# Altium schematic sheet FPGA_MGT.SchDoc: =ProjectTitle
size A3; Author: Jaime I. Chait; Organization: NWES LLC; Address1: 111 SW 5th Ave, STE 3150; Address2: Portland, OR 97204; SheetNumber: 16; SheetTotal: 19
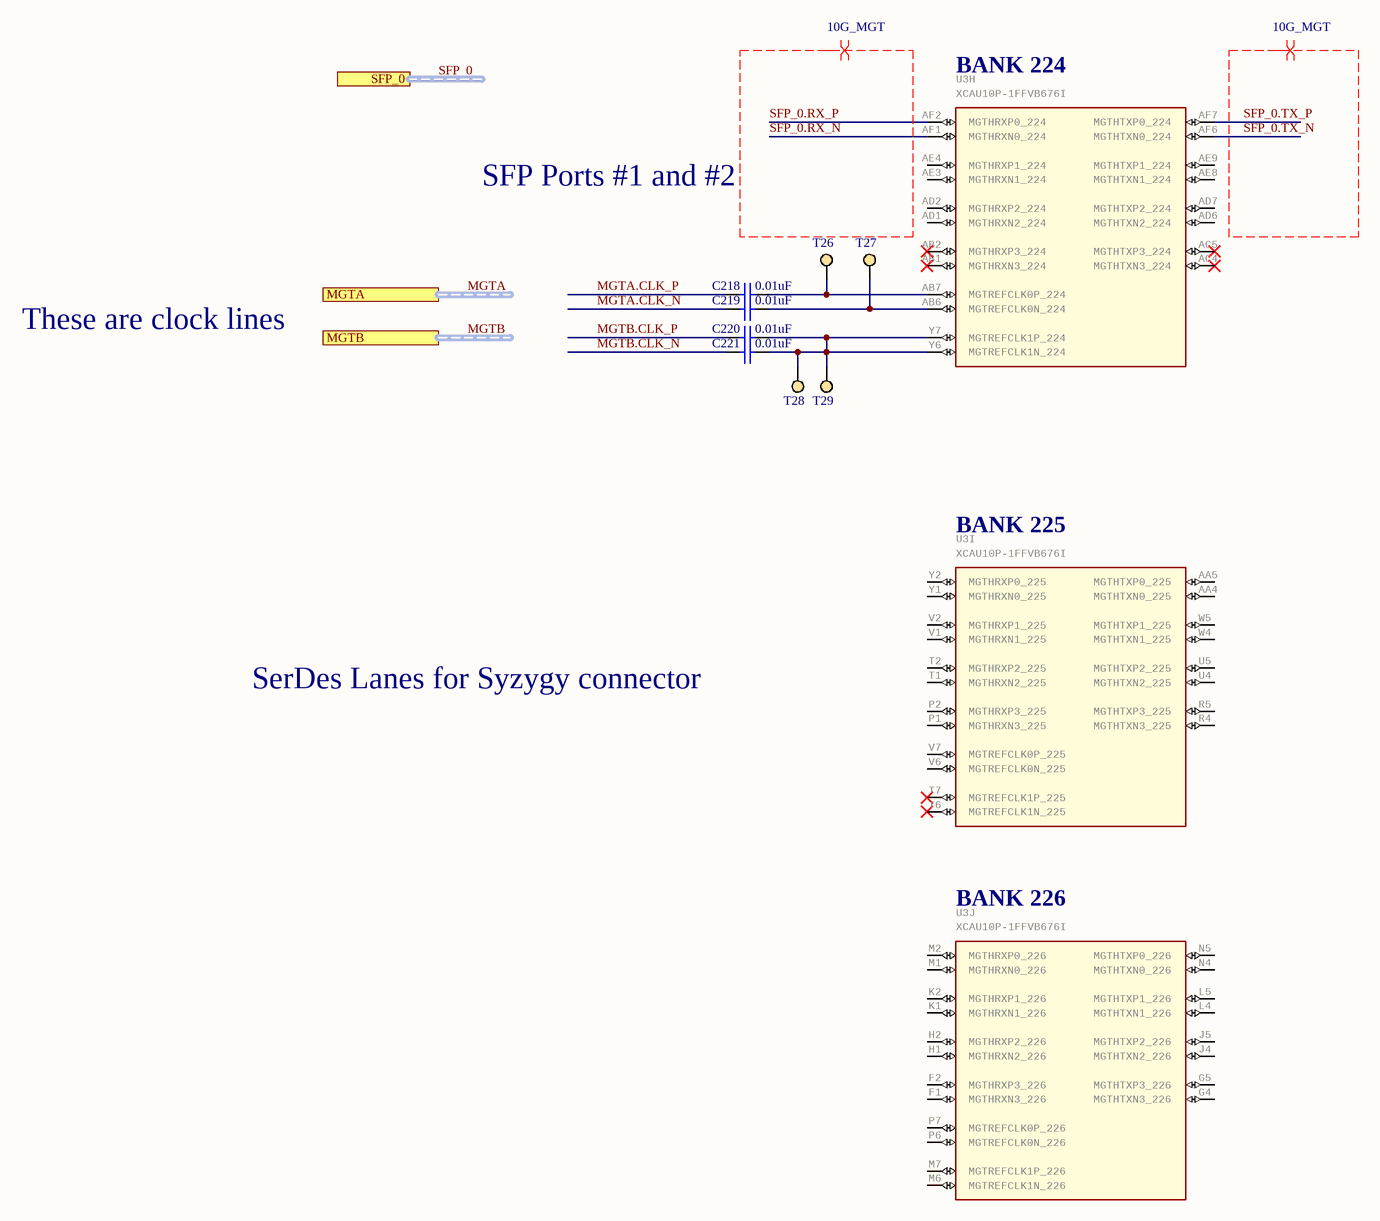
[diagram p0: FPGA_MGT.SchDoc]

## Parts
C218  0.01uF  [CAPC1005X55USR]
C219  0.01uF  [CAPC1005X55USR]
C220  0.01uF  [CAPC1005X55USR]
C221  0.01uF  [CAPC1005X55USR]
T26  TP_S  [TP_SM_1MM]  (value not drawn)  (no BOM)
T27  TP_S  [TP_SM_1MM]  (value not drawn)  (no BOM)
T28  TP_S  [TP_SM_1MM]  (value not drawn)  (no BOM)
T29  TP_S  [TP_SM_1MM]  (value not drawn)  (no BOM)
U3  XCAU10P-1FFVB676I  [676-FCBGA (27x27)]  (parts H,I,J of 16)

## Ports
MGTA (harness DIFF_CLK), MGTB (harness DIFF_CLK), SFP_0 (harness SFT_MGT)

## Nets
MGTA.CLK_N: C219.1
MGTA.CLK_P: C218.1
MGTB.CLK_N: C221.1
MGTB.CLK_P: C220.1
SFP_0.RX_N: U3.AF1(MGTHRXN0_224)
SFP_0.RX_P: U3.AF2(MGTHRXP0_224)
SFP_0.TX_N: U3.AF6(MGTHTXN0_224)
SFP_0.TX_P: U3.AF7(MGTHTXP0_224)
NetC218_2: C218.2 T26.1 U3.AB7(MGTREFCLK0P_224)
NetC219_2: C219.2 T27.1 U3.AB6(MGTREFCLK0N_224)
NetC220_2: C220.2 C221.2 T28.1 T29.1 U3.Y6(MGTREFCLK1N_224) U3.Y7(MGTREFCLK1P_224)

Not connected (* = marked no-connect by the designer): U3 AA4(MGTHTXN0_225) AA5(MGTHTXP0_225) AB1(MGTHRXN3_224)* AB2(MGTHRXP3_224)* AC4(MGTHTXN3_224)* AC5(MGTHTXP3_224)* AD1(MGTHRXN2_224) AD2(MGTHRXP2_224) AD6(MGTHTXN2_224) AD7(MGTHTXP2_224) AE3(MGTHRXN1_224) AE4(MGTHRXP1_224) AE8(MGTHTXN1_224) AE9(MGTHTXP1_224) F1(MGTHRXN3_226) F2(MGTHRXP3_226) G4(MGTHTXN3_226) G5(MGTHTXP3_226) H1(MGTHRXN2_226) H2(MGTHRXP2_226) J4(MGTHTXN2_226) J5(MGTHTXP2_226) K1(MGTHRXN1_226) K2(MGTHRXP1_226) L4(MGTHTXN1_226) L5(MGTHTXP1_226) M1(MGTHRXN0_226) M2(MGTHRXP0_226) M6(MGTREFCLK1N_226) M7(MGTREFCLK1P_226) N4(MGTHTXN0_226) N5(MGTHTXP0_226) P1(MGTHRXN3_225) P2(MGTHRXP3_225) P6(MGTREFCLK0N_226) P7(MGTREFCLK0P_226) R4(MGTHTXN3_225) R5(MGTHTXP3_225) T1(MGTHRXN2_225) T2(MGTHRXP2_225) T6(MGTREFCLK1N_225)* T7(MGTREFCLK1P_225)* U4(MGTHTXN2_225) U5(MGTHTXP2_225) V1(MGTHRXN1_225) V2(MGTHRXP1_225) V6(MGTREFCLK0N_225) V7(MGTREFCLK0P_225) W4(MGTHTXN1_225) W5(MGTHTXP1_225) Y1(MGTHRXN0_225) Y2(MGTHRXP0_225)

## Buses and harness runs
harness MGTA = port MGTA
harness MGTB = port MGTB
harness SFP_0 = port SFP_0

## Layout directives
differential pair; differential pair class 10G_MGT: SFP_0.RX_N, SFP_0.RX_P, SFP_0.TX_N, SFP_0.TX_P

## Notes on the sheet
- SFP Ports #1 and #2
- These are clock lines
- SerDes Lanes for Syzygy connector
- Title
- Size:
- Date:
- A4
- Number:
- Time:
- Revision:
- Sheet
- of
- File:
- (in symbol XCAU10P-1FFVB676I, part H) BANK 224
- (in symbol XCAU10P-1FFVB676I, part I) BANK 225
- (in symbol XCAU10P-1FFVB676I, part J) BANK 226

## Library data of the parts
C218-C221 = CAP CER 0.01uF 50V X7R 0402: CAP CER 10000PF 50V X7R 0402; Manufacturer Part Number: GCM155R71H103KA55D; Manufacturer: Murata Electronics; Supplier Part Number 1: 490-4762-1-ND; Package: 0402; Height: 0.55mm; Supplier 1: Digi-Key; value: 0.01uF
T26-T29 = Test point PAD: test point
U3 = XCAU10P-1FFVB676I: IC FPGA ARTIXUP 676BGA; Manufacturer: AMD Xilinx; Manufacturer Part Number: XCAU10P-1FFVB676I; Supplier Part Number 1: 122-XCAU10P-1FFVB676I-ND; Supplier 1: Supplier